# EAGLE design 8x8matrix_alt2 (EAGLE 6.5.0)
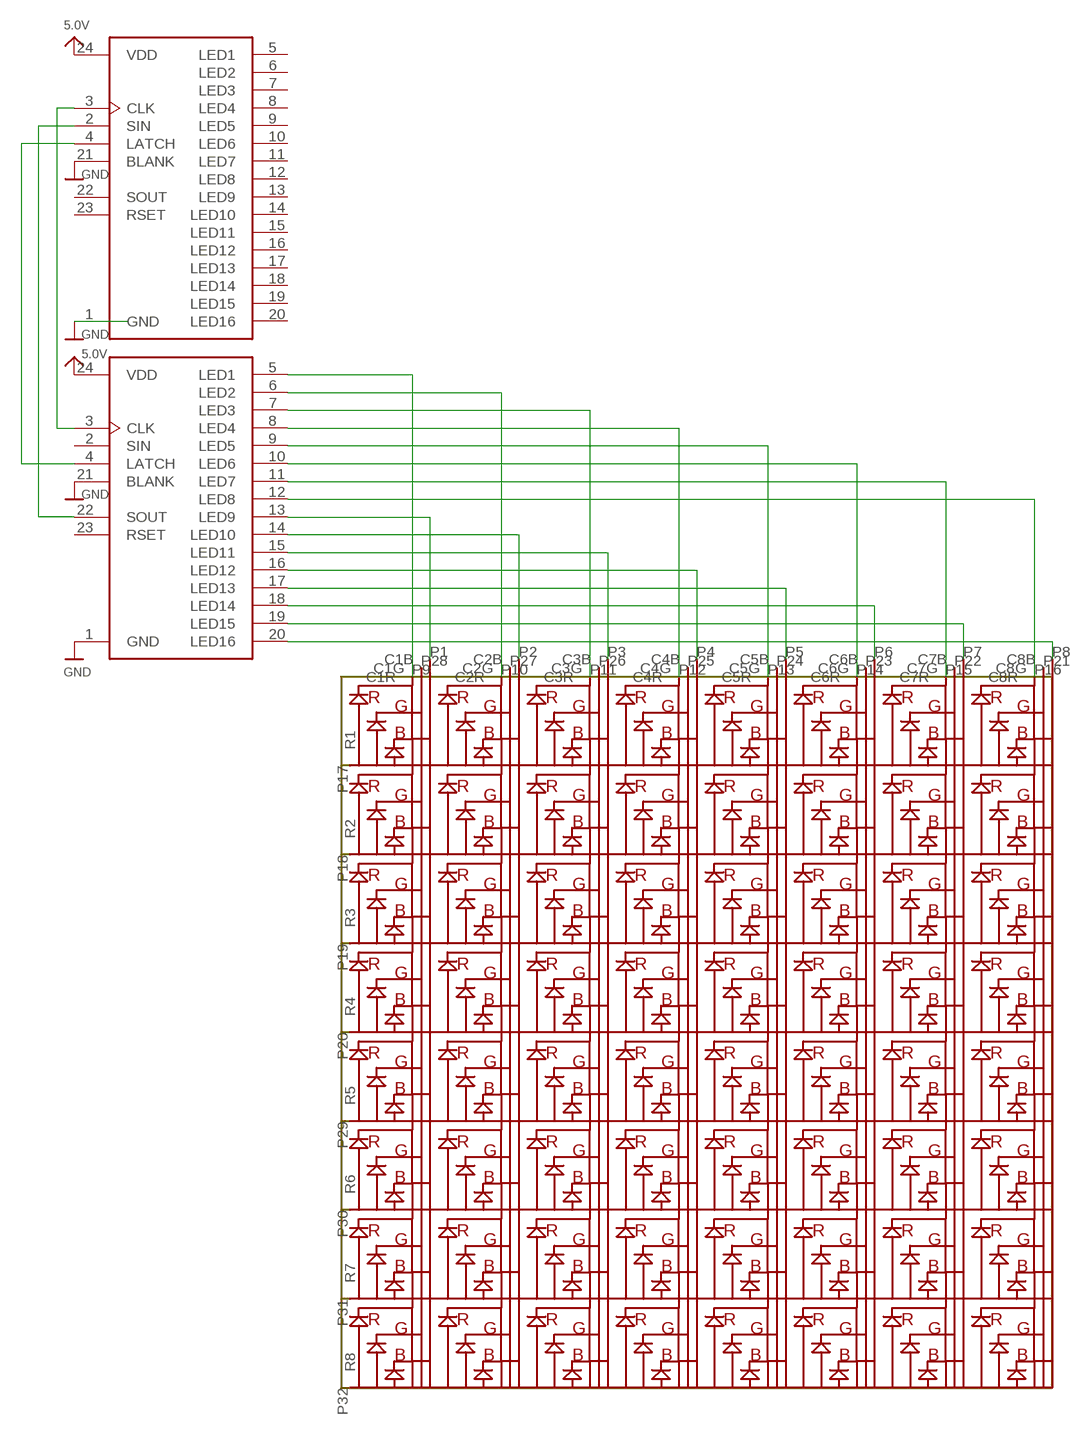
[diagram p0: schematic, sheet 1]

## Parts
U$1  GTM2088ARGB  [8X8MATRIX]
U$2  CAT4016W  [TSSOP24]
U$3  CAT4016W  [TSSOP24]

## Nets
5.0V: U$2.24(VDD) U$3.24(VDD)
GND: U$2.1(GND) U$2.21(BLANK) U$3.1(GND) U$3.21(BLANK)
N$1: U$1.P9(C1R) U$3.5(LED1)
N$2: U$1.P10(C2R) U$3.6(LED2)
N$3: U$1.P11(C3R) U$3.7(LED3)
N$4: U$1.P12(C4R) U$3.8(LED4)
N$5: U$1.P13(C5R) U$3.9(LED5)
N$6: U$1.P14(C6R) U$3.10(LED6)
N$7: U$1.P15(C7R) U$3.11(LED7)
N$8: U$1.P16(C8R) U$3.12(LED8)
N$9: U$1.P1(C1B) U$3.13(LED9)
N$10: U$1.P2(C2B) U$3.14(LED10)
N$11: U$1.P3(C3B) U$3.15(LED11)
N$12: U$1.P4(C4B) U$3.16(LED12)
N$13: U$1.P5(C5B) U$3.17(LED13)
N$14: U$1.P6(C6B) U$3.18(LED14)
N$15: U$1.P7(C7B) U$3.19(LED15)
N$16: U$1.P8(C8B) U$3.20(LED16)
N$25: U$2.3(CLK) U$3.3(CLK)
N$26: U$2.2(SIN) U$3.22(SOUT)
N$27: U$2.4(LATCH) U$3.4(LATCH)
Unconnected: U$1.P17(R1) U$1.P18(R2) U$1.P19(R3) U$1.P20(R4) U$1.P21(C8G) U$1.P22(C7G) U$1.P23(C6G) U$1.P24(C5G) U$1.P25(C4G) U$1.P26(C3G) U$1.P27(C2G) U$1.P28(C1G) U$1.P29(R5) U$1.P30(R6) U$1.P31(R7) U$1.P32(R8) U$2.5(LED1) U$2.6(LED2) U$2.7(LED3) U$2.8(LED4) U$2.9(LED5) U$2.10(LED6) U$2.11(LED7) U$2.12(LED8) U$2.13(LED9) U$2.14(LED10) U$2.15(LED11) U$2.16(LED12) U$2.17(LED13) U$2.18(LED14) U$2.19(LED15) U$2.20(LED16) U$2.22(SOUT) U$2.23(RSET) U$3.2(SIN) U$3.23(RSET)

## Library data of the parts
U$1 = mylib:GTM2088ARGB: a 8x8 RGB matrix
U$2 U$3 = CAT4016:CAT4016: 16-Channel Constant Current LED Driver

## Board
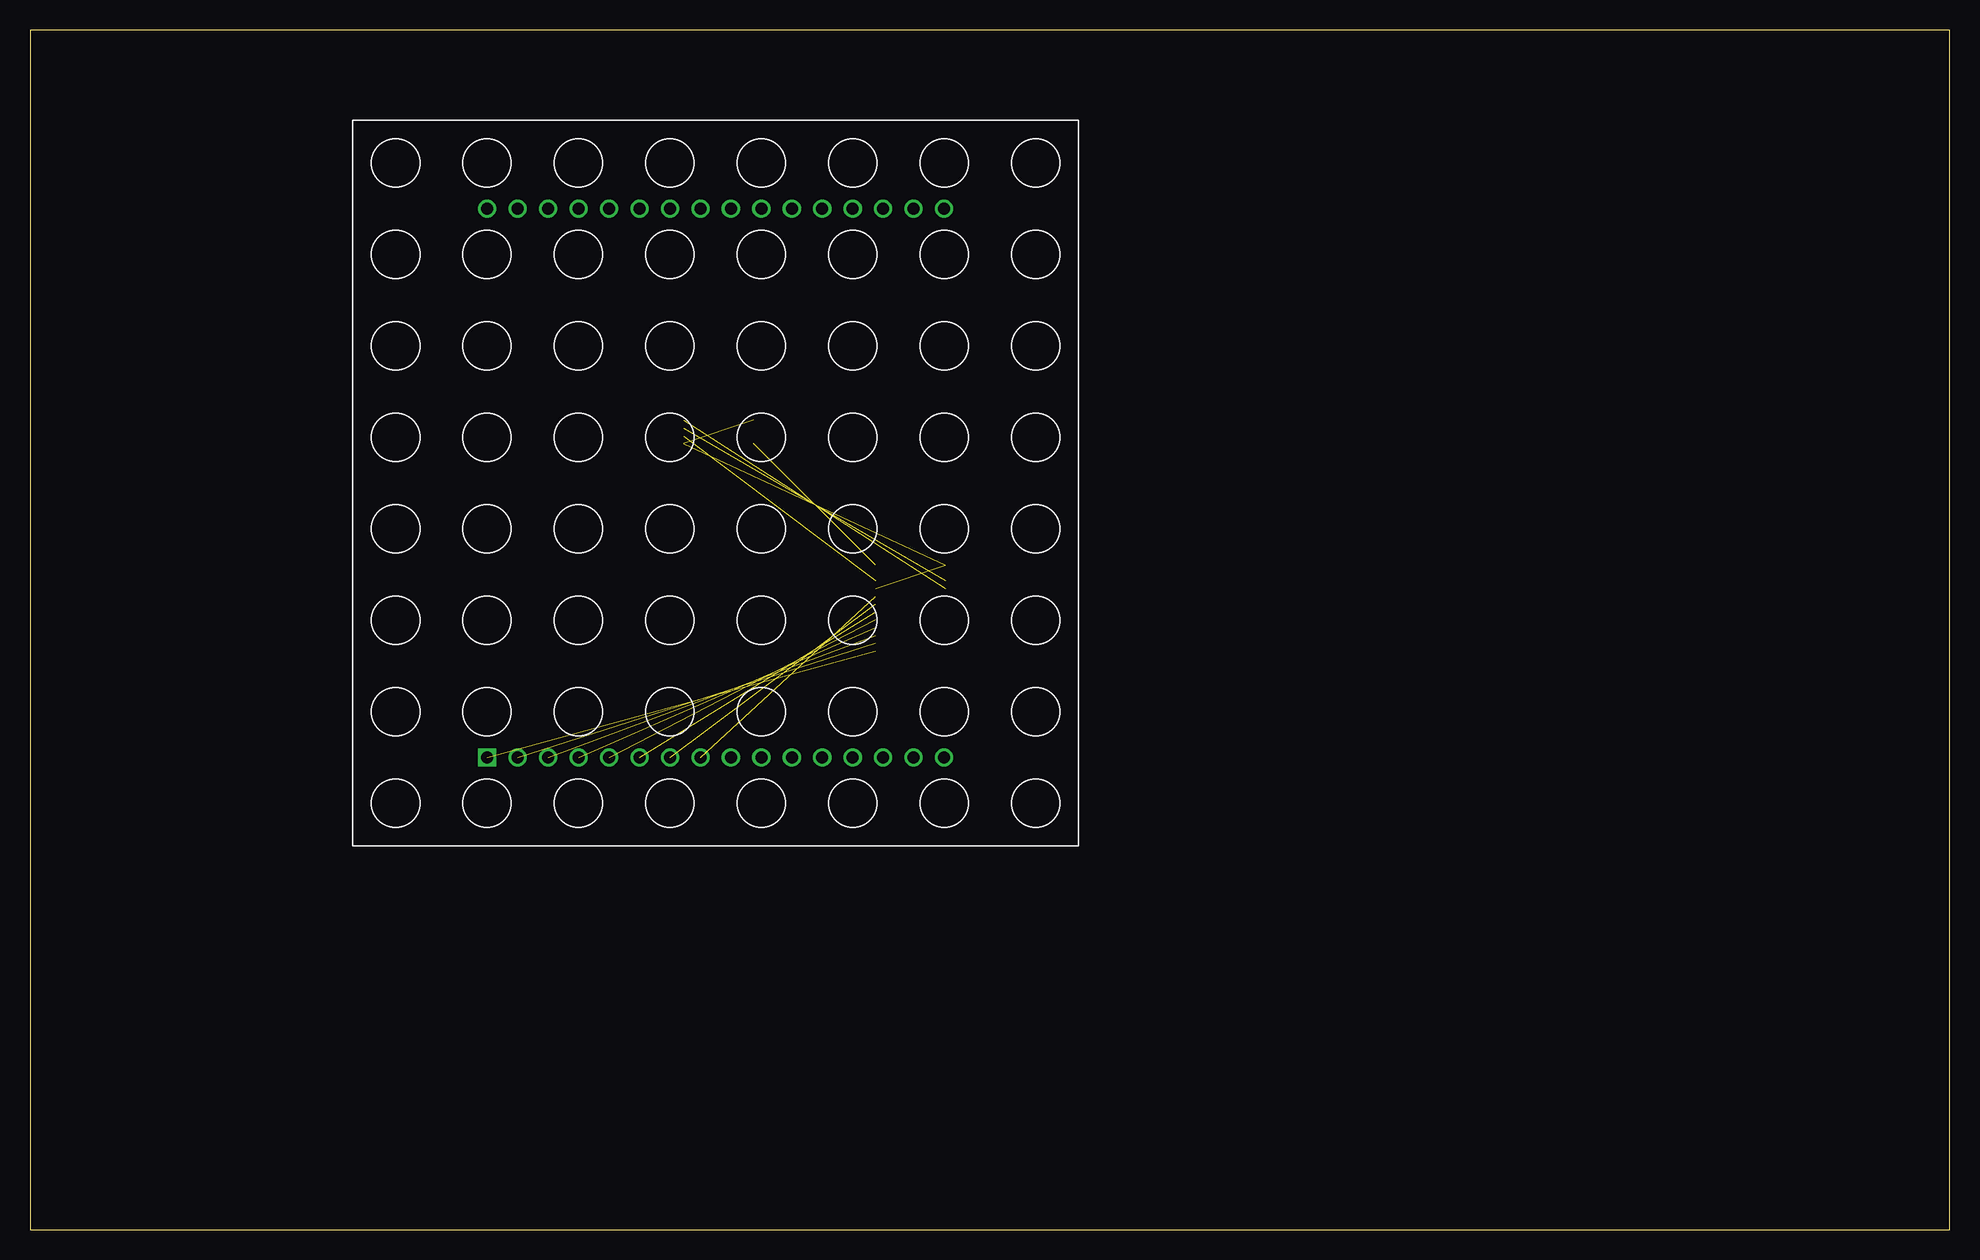
[diagram p1: board, top side]
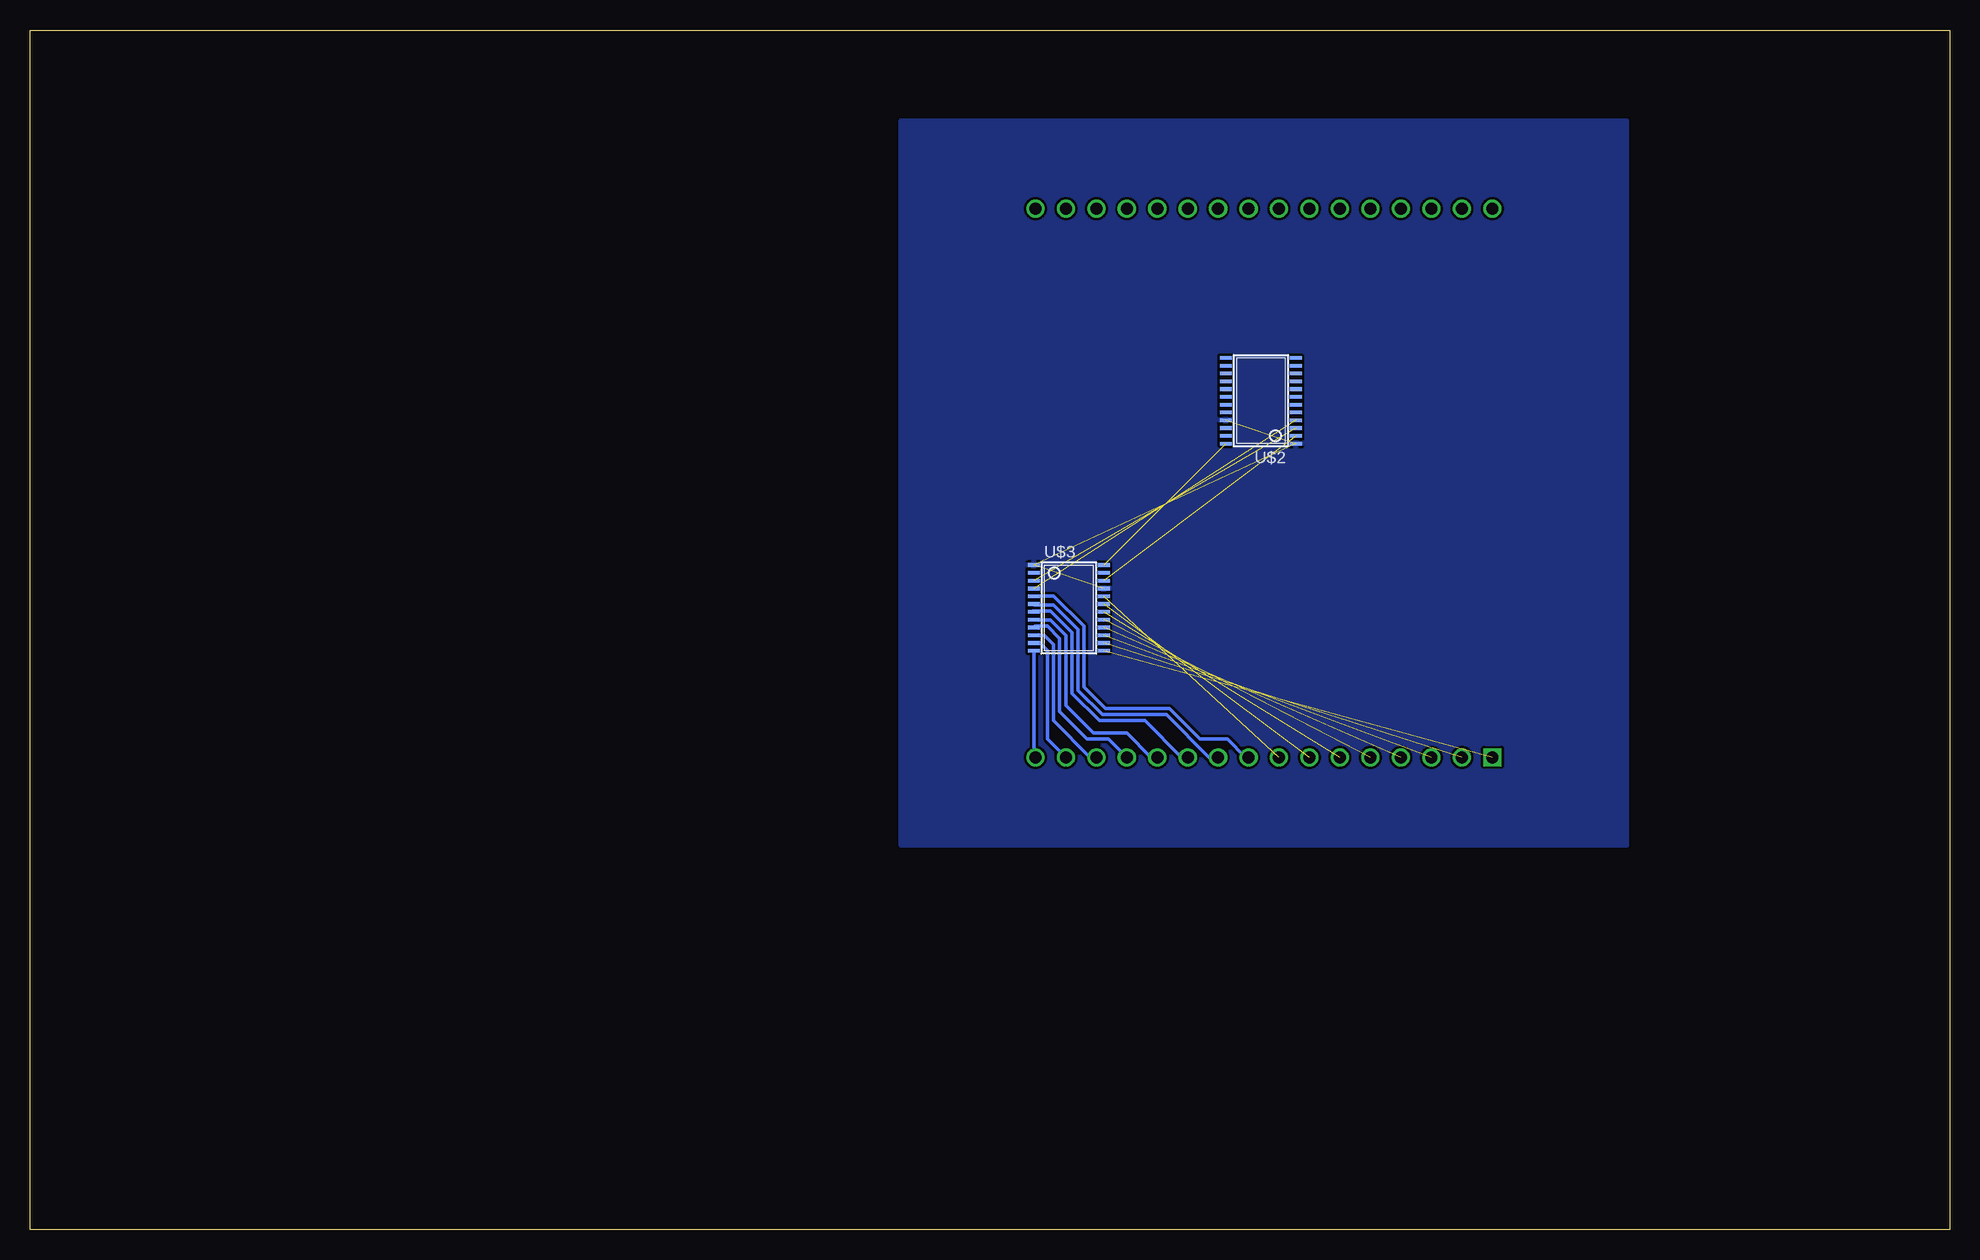
[diagram p2: board, bottom side, seen from below]

Size 160 x 100 mm. Coordinates in mm from the lower left corner, seen from the top.
Outline: 0,0 160,0 160,100 0,100 0,0
Copper layers (1*16): Top 0.035mm / dielectric 1.5mm / Bottom 0.035mm
Design rules "default": minimum track width 10mil, minimum drill 24mil, track to track 8mil, track to pad 8mil, pad to pad 8mil, via to via 8mil, smd to smd 8mil, copper to edge 40mil, drill to drill 8mil, minimum pad ring 10mil, minimum via ring 8mil, stop-mask expansion 4mil, vias tented up to drill 0mil, thermal gap 10mil

### Footprints (pad centres in the part's own frame; a part is rotated, then mirrored left to right if it is on the bottom)
8X8MATRIX = drill 1 square: P1 -19.05,-22.86 | drill 1: P2 -16.51,-22.86; P3 -13.97,-22.86; P4 -11.43,-22.86; P5 -8.89,-22.86; P6 -6.35,-22.86; P7 -3.81,-22.86; P8 -1.27,-22.86; P9 1.27,-22.86; P10 3.81,-22.86; P11 6.35,-22.86; P12 8.89,-22.86; P13 11.43,-22.86; P14 13.97,-22.86; P15 16.51,-22.86; P16 19.05,-22.86; P17 19.05,22.86; P18 16.51,22.86; P19 13.97,22.86; P20 11.43,22.86; P21 8.89,22.86; P22 6.35,22.86; P23 3.81,22.86; P24 1.27,22.86; P25 -1.27,22.86; P26 -3.81,22.86; P27 -6.35,22.86; P28 -8.89,22.86; P29 -11.43,22.86; P30 -13.97,22.86; P31 -16.51,22.86; P32 -19.05,22.86
TSSOP24 = smd 0.305 x 0.991: 1 -3.575,-2.918; 2 -2.925,-2.918; 3 -2.275,-2.918; 4 -1.625,-2.918; 5 -0.975,-2.918; 6 -0.325,-2.918; 7 0.325,-2.918; 8 0.975,-2.918; 9 1.625,-2.918; 10 2.275,-2.918; 11 2.925,-2.918; 12 3.575,-2.918; 13 3.575,2.918; 14 2.925,2.918; 15 2.275,2.918; 16 1.625,2.918; 17 0.975,2.918; 18 0.325,2.918; 19 -0.325,2.918; 20 -0.975,2.918; 21 -1.625,2.918; 22 -2.275,2.918; 23 -2.925,2.918; 24 -3.575,2.918

### Placement (x,y rotation side)
U$1  57.15,62.23 0 top
U$2  57.4,69.09 90 bottom
U$3  73.41,51.82 270 bottom

### Tracks (layer width: path | path; a pad name or v marks a point on that pad's centre or on a via)
5.0V  (1 unrouted)
GND  (3 unrouted)
  pour Bottom: 26.92,92.46 26.92,32 87.38,32 87.38,92.46
N$1
  Bottom 0.305: U$1.P9 58.67,39.37 60.2,40.89 62.48,40.89 65.02,43.43 70.36,43.43 72.14,45.21 72.14,50.29 74.68,52.83 76.28,52.83 U$3.5
N$2
  Bottom 0.305: U$1.P10 61.72,39.37 65.28,42.93 70.61,42.93 72.64,44.96 72.64,50.04 74.68,52.07 76.25,52.07 U$3.6
N$3
  Bottom 0.305: U$1.P11 64.01,39.37 67.06,42.42 70.87,42.42 73.15,44.7 73.15,49.78 74.93,51.56 76.39,51.56 U$3.7
N$4
  Bottom 0.305: U$1.P12 66.55,39.37 68.58,41.4 71.37,41.4 73.66,43.69 73.66,49.53 74.93,50.8 76.28,50.8 U$3.8
N$5
  Bottom 0.305: U$1.P13 70.1,40.89 71.88,40.89 74.17,43.18 74.17,49.28 75.18,50.29 76.22,50.29 U$3.9
N$6
  Bottom 0.305: U$1.P14 71.63,39.37 74.68,42.42 74.68,48.77 75.44,49.53 U$3.10
N$7
  Bottom 0.305: U$3.11 75.81,48.89 75.18,48.26 75.18,40.89 U$1.P15
N$8
  Bottom 0.305: U$3.12 76.32,39.49 U$1.P16
N$9  (1 unrouted)
N$10  (1 unrouted)
N$11  (1 unrouted)
N$12  (1 unrouted)
N$13  (1 unrouted)
N$14  (1 unrouted)
N$15  (1 unrouted)
N$16  (1 unrouted)
N$25  (1 unrouted)
N$26  (1 unrouted)
N$27  (1 unrouted)